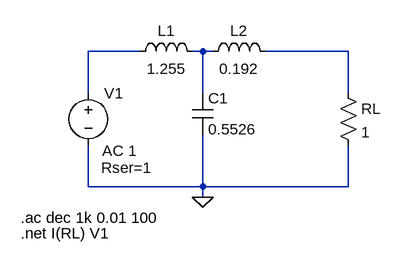
[diagram p0: schematic EJ1.asc]
EJ1.asc, the LTspice schematic file:
Version 4
SHEET 1 880 680
WIRE 32 96 -48 96
WIRE 128 96 112 96
WIRE 144 96 128 96
WIRE 352 96 224 96
WIRE -48 160 -48 96
WIRE 128 160 128 96
WIRE 352 160 352 96
WIRE -48 304 -48 240
WIRE 128 304 128 224
WIRE 128 304 -48 304
WIRE 352 304 352 240
WIRE 352 304 128 304
WIRE 128 320 128 304
FLAG 128 320 0
SYMBOL voltage -48 144 R0
WINDOW 123 21 105 Left 2
WINDOW 39 20 131 Left 2
SYMATTR Value2 AC 1
SYMATTR SpiceLine Rser=1
SYMATTR InstName V1
SYMATTR Value ""
SYMBOL ind 16 112 R270
WINDOW 0 32 56 VTop 2
WINDOW 3 5 56 VBottom 2
SYMATTR InstName L1
SYMATTR Value 1.255
SYMBOL cap 112 160 R0
SYMATTR InstName C1
SYMATTR Value 0.5526
SYMBOL ind 128 112 R270
WINDOW 0 32 56 VTop 2
WINDOW 3 5 56 VBottom 2
SYMATTR InstName L2
SYMATTR Value 0.192
SYMBOL res 336 144 R0
SYMATTR InstName RL
SYMATTR Value 1
TEXT -152 352 Left 2 !.ac dec 1k 0.01 100
TEXT -152 376 Left 2 !.net I(RL) V1

The netlist it stands for:
* EJ1.asc
V1 N001 0 AC 1 Rser=1
L1 N001 N002 1.255
C1 N002 0 0.5526
L2 N002 N003 0.192
RL N003 0 1
.ac dec 1k 0.01 100
.net I(RL) V1
.backanno
.end